# Altium schematic sheet wheatstone_bridge.SchDoc
size A4; SheetNumber: 2; SheetTotal: 3
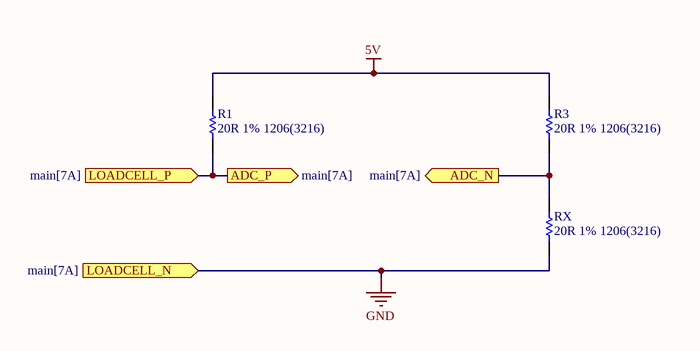
[diagram p0: wheatstone_bridge.SchDoc]

## Parts
R1  20R 1% 1206(3216)  [RESC1206(3216)_M]
R3  20R 1% 1206(3216)  [RESC1206(3216)_M]
RX  20R 1% 1206(3216)  [RESC1206(3216)_M]

## Ports
ADC_N (out, see main[7A]), ADC_P (out, see main[7A]), LOADCELL_N (in, see main[7A]), LOADCELL_P (in, see main[7A])

## Nets
5V: R1.2 R3.2
GND: RX.1 ; port LOADCELL_N
ADC_N: R3.1 RX.2 ; port ADC_N
ADC_P: R1.1 ; port LOADCELL_P, port ADC_P

## Library data of the parts
R1 R3 RX = CMP-1014-00316-1: 20R 0.25W 1% 1206 (3216 Metric)  SMD; Case-Metric: 3216; Case-EIA: 1206; Value: 20.00 Ohm; Tolerance: 1 %; Technology: SMT; Power: 0.25 W